# Altium project koruza-compute-module-board.PrjPcb (part 4 of 6)

## Sheet PAGE3 - HUB, USB, ETH.SchDoc
size A3; DocumentNumber: 3; SheetNumber: 3; SheetTotal: 4
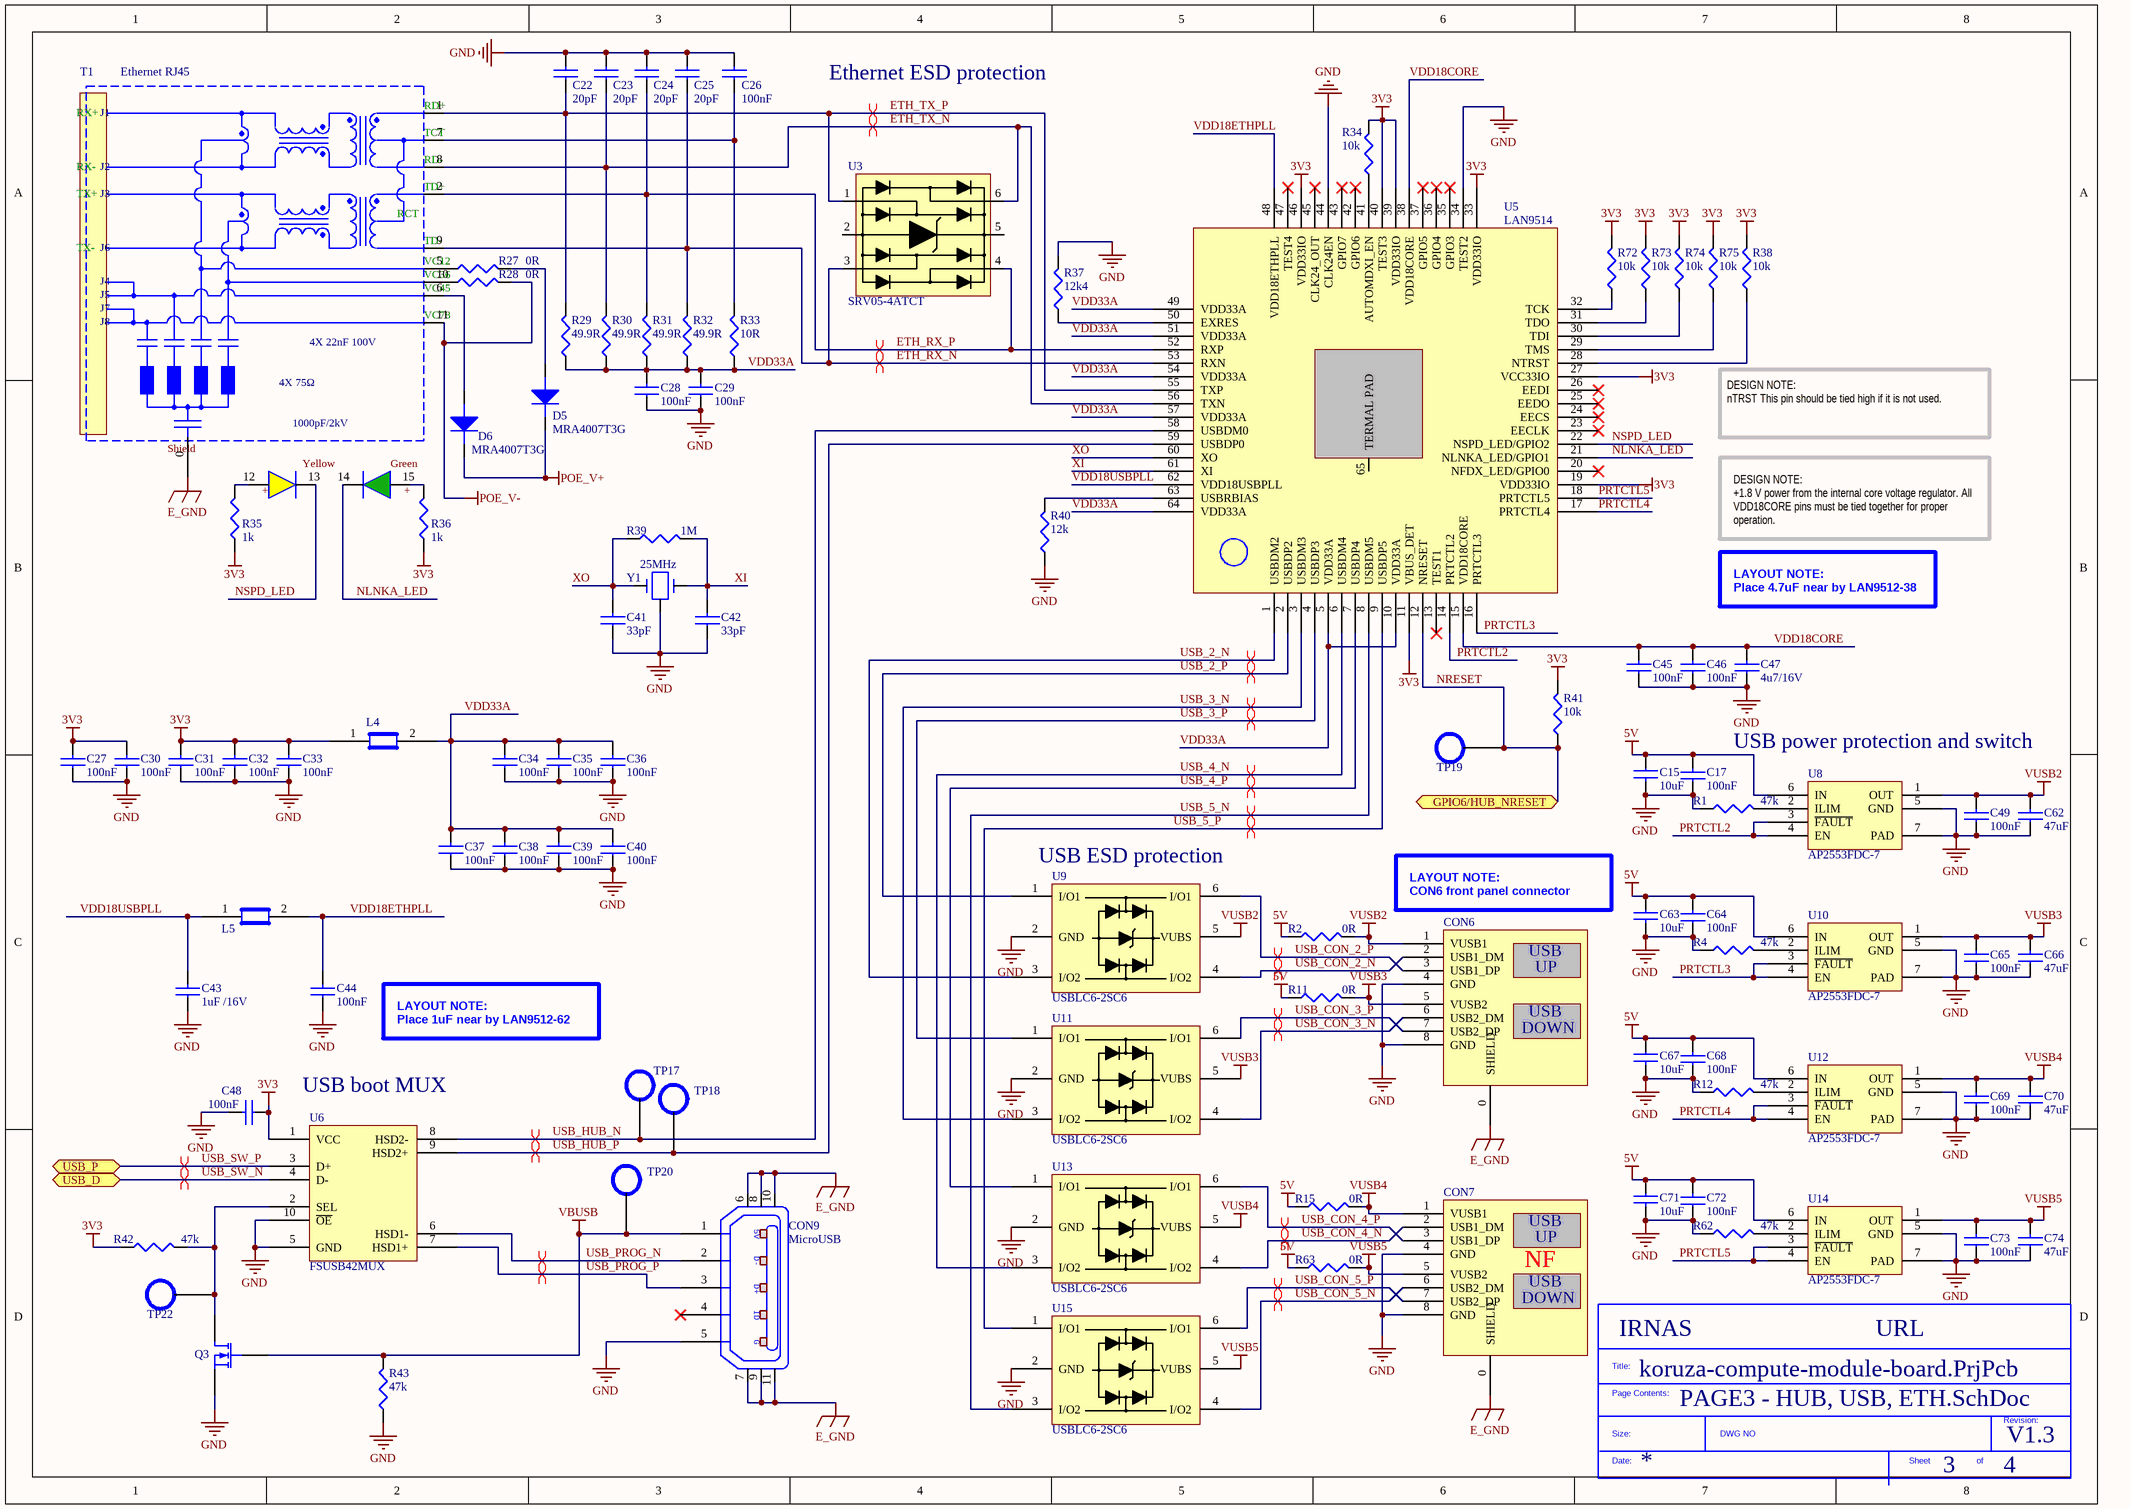
[diagram p3: PAGE3 - HUB, USB, ETH.SchDoc]

### Parts
(Parts that share a designator on the sheet are numbered #1, #2 ... from top to bottom, then left to right.)
*?#3  SDTitleBlock  (value not drawn)  (graphical)
C15  10uF  [CAP1206]
C17  100nF  [CAP0603]
C22  20pF  [CAP0603]
C23  20pF  [CAP0603]
C24  20pF  [CAP0603]
C25  20pF  [CAP0603]
C26  100nF  [CAP0603]
C27  100nF  [CAP0603]
C28  100nF  [CAP0603]
C29  100nF  [CAP0603]
C30  100nF  [CAP0603]
C31  100nF  [CAP0603]
C32  100nF  [CAP0603]
C33  100nF  [CAP0603]
C34  100nF  [CAP0603]
C35  100nF  [CAP0603]
C36  100nF  [CAP0603]
C37  100nF  [CAP0603]
C38  100nF  [CAP0603]
C39  100nF  [CAP0603]
C40  100nF  [CAP0603]
C41  33pF  [CAP0603]
C42  33pF  [CAP0603]
C43  1uF /16V  [CAP0603]
C44  100nF  [CAP0603]
C45  100nF  [CAP0603]
C46  100nF  [CAP0603]
C47  4u7/16V  [CAP0603]
C48  100nF  [CAP0603]
C49  100nF  [CAP0603]
C62  47uF  [CAP0805]
C63  10uF  [CAP1206]
C64  100nF  [CAP0603]
C65  100nF  [CAP0603]
C66  47uF  [CAP0805]
C67  10uF  [CAP1206]
C68  100nF  [CAP0603]
C69  100nF  [CAP0603]
C70  47uF  [CAP0805]
C71  10uF  [CAP1206]
C72  100nF  [CAP0603]
C73  100nF  [CAP0603]
C74  47uF  [CAP0805]
CON6  DUAL USB CONNECTOR  [DUAL_USB_CONN]  (value not drawn)
CON7  DUAL USB CONNECTOR  [DUAL_USB_CONN]  (value not drawn)
CON9  MicroUSB  [10118193]
D5  MRA4007T3G  [DIOM4326X24N_1]
D6  MRA4007T3G  [DIOM4326X24N_1]
L4  BLM18EG221SN1D  [CAP0603]  (value not drawn)
L5  BLM18EG221SN1D  [CAP0603]  (value not drawn)
Q3  DMG1012T-7  [DMG1012T-7]  (value not drawn)
R1  47k  [RES0603]
R2  0R  [RES0603]
R4  47k  [RES0603]
R11  0R  [RES0603]
R12  47k  [RES0603]
R15  0R  [RES0603]
R27  0R  [RES1206]
R28  0R  [RES1206]
R29  49.9R  [RES0603]
R30  49.9R  [RES0603]
R31  49.9R  [RES0603]
R32  49.9R  [RES0603]
R33  10R  [RES0603]
R34  10k  [RES0603]
R35  1k  [RES0603]
R36  1k  [RES0603]
R37  12k4  [RES0603]
R38  10k  [RES0603]
R39  1M  [RES0603]
R40  12k  [RES0603]
R41  10k  [RES0603]
R42  47k  [RES0603]
R43  47k  [RES0603]
R62  47k  [RES0603]
R63  0R  [RES0603]
R72  10k  [RES0603]
R73  10k  [RES0603]
R74  10k  [RES0603]
R75  10k  [RES0603]
T1  Ethernet RJ45  [0826-1L1T-57-F]
TP17  TEST_POINT  [TEST_POINT]  (value not drawn)  (no BOM)
TP18  TEST_POINT  [TEST_POINT]  (value not drawn)  (no BOM)
TP19  TEST_POINT  [TEST_POINT]  (value not drawn)  (no BOM)
TP20  TEST_POINT  [TEST_POINT]  (value not drawn)  (no BOM)
TP22  TEST_POINT  [TEST_POINT]  (value not drawn)  (no BOM)
U3  SRV05-4ATCT  [SOT23127P600-8N]
U5  LAN9514  [QFN64]
U6  FSUSB42MUX  [MO-187]
U8  AP2553FDC-7  [SON65P200X63_HS-7N]
U9  USBLC6-2SC6  [SOT23127P600-8N]
U10  AP2553FDC-7  [SON65P200X63_HS-7N]
U11  USBLC6-2SC6  [SOT23127P600-8N]
U12  AP2553FDC-7  [SON65P200X63_HS-7N]
U13  USBLC6-2SC6  [SOT23127P600-8N]
U14  AP2553FDC-7  [SON65P200X63_HS-7N]
U15  USBLC6-2SC6  [SOT23127P600-8N]
Y1  25MHz  [XTAL_small]

### Ports
GPIO6/HUB_NRESET (bidir), USB_D (bidir), USB_P (bidir)

### Nets
3V3: C27.2 C30.2 C31.2 C32.2 C33.2 C48.1 L4.1 R34.2 R35.1 R36.1 R38.2 R41.2 R42.1 R72.2 R73.2 R74.2 R75.2 U5.11(VBUS_DET) U5.19(VDD33IO) U5.27(VCC33IO) U5.33(VDD33IO) U5.39(VDD33IO) U5.40(TEST3) U5.46(VDD33IO) U6.1(VCC)
5V: C15.1 C17.2 C63.1 C64.2 C67.1 C68.2 C71.1 C72.2 R2.1 R11.1 R15.1 R63.1 U8.6(IN) U10.6(IN) U12.6(IN) U14.6(IN)
E_GND: CON6.0(SHIELD) CON7.0(SHIELD) CON9.6 CON9.7 CON9.8 CON9.9 CON9.10 CON9.11 T1.0(Shield)
GND: C15.2 C17.1 C22.2 C23.2 C24.2 C25.2 C26.2 C27.1 C28.1 C29.1 C30.1 C31.1 C32.1 C33.1 C34.1 C35.1 C36.1 C37.1 C38.1 C39.1 C40.1 C41.1 C42.1 C43.1 C44.1 C45.1 C46.1 C47.1 C48.2 C49.1 C62.1 C63.2 C64.1 C65.1 C66.1 C67.2 C68.1 C69.1 C70.1 C71.2 C72.1 C73.1 C74.1 CON6.4(GND) CON6.8(GND) CON7.4(GND) CON7.8(GND) CON9.5(P5) Q3.3(S) R1.1 R4.1 R12.1 R37.2 R40.1 R43.1 R62.1 U5.34(TEST2) U5.44(CLK24EN) U5.65(TERMAL_PAD) U6.5(GND) U6.10(~{OE}) U8.5(GND) U8.7(PAD) U9.2(GND) U10.5(GND) U10.7(PAD) U11.2(GND) U12.5(GND) U12.7(PAD) U13.2(GND) U14.5(GND) U14.7(PAD) U15.2(GND) Y1.3
POE_V+: D5.1(cathode) D6.1(cathode)
POE_V-: R28.2 T1.11(VC78)
VBUSB: CON9.1(P1) Q3.2(G) R43.2 TP20.1(TP)
VUSB2: C49.2 C62.2 CON6.1(VUSB1) R2.2 U8.1(OUT) U9.5(VUBS)
VUSB3: C65.2 C66.2 CON6.5(VUSB2) R11.2 U10.1(OUT) U11.5(VUBS)
VUSB4: C69.2 C70.2 CON7.1(VUSB1) R15.2 U12.1(OUT) U13.5(VUBS)
VUSB5: C73.2 C74.2 CON7.5(VUSB2) R63.2 U14.1(OUT) U15.5(VUBS)
ETH_RX_N: C25.1 R32.2 T1.9(TD-) U3.3 U5.53(RXN)
ETH_RX_P: C24.1 R31.2 T1.2(TD+) U3.4 U5.52(RXP)
ETH_TX_N: C23.1 R30.2 T1.8(RD-) U3.6 U5.56(TXN)
ETH_TX_P: C22.1 R29.2 T1.1(RD+) U3.1 U5.55(TXP)
NLNKA_LED: T1.14 U5.21(NLNKA_LED/GPIO1)
NRESET: R41.1 TP19.1(TP) U5.12(NRESET) ; port GPIO6/HUB_NRESET
NSPD_LED: T1.13 U5.22(NSPD_LED/GPIO2)
PRTCTL2: U5.14(PRTCTL2) U8.3(~{FAULT}) U8.4(EN)
PRTCTL3: U5.16(PRTCTL3) U10.3(~{FAULT}) U10.4(EN)
PRTCTL4: U5.17(PRTCTL4) U12.3(~{FAULT}) U12.4(EN)
PRTCTL5: U5.18(PRTCTL5) U14.3(~{FAULT}) U14.4(EN)
USB_2_N: U5.1(USBDM2) U9.3(I/O2)
USB_2_P: U5.2(USBDP2) U9.1(I/O1)
USB_3_N: U5.3(USBDM3) U11.3(I/O2)
USB_3_P: U5.4(USBDP3) U11.1(I/O1)
USB_4_N: U5.6(USBDM4) U13.3(I/O2)
USB_4_P: U5.7(USBDP4) U13.1(I/O1)
USB_5_N: U5.8(USBDM5) U15.3(I/O2)
USB_5_P: U5.9(USBDP5) U15.1(I/O1)
USB_CON_2_N: CON6.2(USB1_DM) U9.4(I/O2)
USB_CON_2_P: CON6.3(USB1_DP) U9.6(I/O1)
USB_CON_3_N: CON6.6(USB2_DM) U11.4(I/O2)
USB_CON_3_P: CON6.7(USB2_DP) U11.6(I/O1)
USB_CON_4_N: CON7.2(USB1_DM) U13.4(I/O2)
USB_CON_4_P: CON7.3(USB1_DP) U13.6(I/O1)
USB_CON_5_N: CON7.6(USB2_DM) U15.4(I/O2)
USB_CON_5_P: CON7.7(USB2_DP) U15.6(I/O1)
USB_HUB_N: TP17.1(TP) U5.58(USBDM0) U6.8(HSD2-)
USB_HUB_P: TP18.1(TP) U5.59(USBDP0) U6.9(HSD2+)
USB_PROG_N: CON9.2(P2) U6.6(HSD1-)
USB_PROG_P: CON9.3(P3) U6.7(HSD1+)
USB_SW_N: U6.4(D-) ; port USB_D
USB_SW_P: U6.3(D+) ; port USB_P
VDD18CORE: C45.2 C46.2 C47.2 U5.15(VDD18CORE) U5.38(VDD18CORE)
VDD18ETHPLL: C44.2 L5.2 U5.48(VDD18ETHPLL)
VDD18USBPLL: C43.2 L5.1 U5.62(VDD18USBPLL)
VDD33A: C28.2 C29.2 C34.2 C35.2 C36.2 C37.2 C38.2 C39.2 C40.2 L4.2 R29.1 R30.1 R31.1 R32.1 R33.1 U5.5(VDD33A) U5.10(VDD33A) U5.49(VDD33A) U5.51(VDD33A) U5.54(VDD33A) U5.57(VDD33A) U5.64(VDD33A)
XI: C42.2 R39.2 U5.61(XI) Y1.2
XO: C41.2 R39.1 U5.60(XO) Y1.1
NetC26_1: C26.1 R33.2 T1.7(CT)
NetD5_2: D5.2(ANODE) R27.2
NetD6_2: D6.2(ANODE) T1.6(VC45)
NetQ3_1: Q3.1(D) R42.2 TP22.1(TP) U6.2(SEL)
NetR1_2: R1.2 U8.2(ILIM)
NetR4_2: R4.2 U10.2(ILIM)
NetR12_2: R12.2 U12.2(ILIM)
NetR27_1: R27.1 T1.5(VC12)
NetR28_1: R28.1 T1.10(VC36)
NetR34_1: R34.1 U5.41(AUTOMDXI_EN)
NetR35_2: R35.2 T1.12
NetR36_2: R36.2 T1.15
NetR37_1: R37.1 U5.50(EXRES)
NetR38_1: R38.1 U5.28(NTRST)
NetR40_2: R40.2 U5.63(USBRBIAS)
NetR62_2: R62.2 U14.2(ILIM)
NetR72_1: R72.1 U5.32(TCK)
NetR73_1: R73.1 U5.31(TDO)
NetR74_1: R74.1 U5.30(TDI)
NetR75_1: R75.1 U5.29(TMS)

Not connected (* = marked no-connect by the designer): CON9 4(P4)*; U3 2 5; U5 13(TEST1)* 20(NFDX_LED/GPIO0)* 23(EECLK)* 24(EECS)* 25(EEDO)* 26(EEDI)* 35(GPIO3)* 36(GPIO4)* 37(GPIO5)* 42(GPIO6)* 43(GPIO7)* 45(CLK24_OUT)* 47(TEST4)*

### Layout directives
differential pair: ETH_RX_N, ETH_RX_P, ETH_TX_N, ETH_TX_P, USB_2_N, USB_2_P, USB_3_N, USB_3_P, USB_4_N, USB_4_P, USB_5_N, USB_5_P, USB_CON_2_N, USB_CON_2_P, USB_CON_3_N, USB_CON_3_P, USB_CON_4_N, USB_CON_4_P, USB_CON_5_N, USB_CON_5_P, USB_HUB_N, USB_HUB_P, USB_PROG_N, USB_PROG_P, USB_SW_N, USB_SW_P

### Notes on the sheet
- Ethernet ESD protection
- DESIGN NOTE:
  nTRST This pin should be tied high if it is not used.
- DESIGN NOTE:
  +1.8 V power from the internal core voltage regulator. All VDD18CORE pins must be tied together for proper operation.
- LAYOUT NOTE:
  Place 4.7uF near by LAN9512-38
- USB power protection and switch
- (near U9) USB ESD protection
- LAYOUT NOTE:
  CON6 front panel connector
- LAYOUT NOTE:
  Place 1uF near by LAN9512-62
- USB boot MUX
- NF
- (in symbol Ethernet RJ45) RX+; J1; TCT; RX-; J2; TX+; J3; RCT; TX-; J6; J4; J5; J7; J8; 4X 22nF 100V; 4X 75Ω; 1000pF/2kV; Yellow; Green; +
- (in symbol MicroUSB) 5V; D-; D+; ID; G
- (in symbol SDTitleBlock) Title:; Page Contents:; Revision:; Size:; DWG NO; Date:; Sheet; of
- (in symbol USB_2_CONN) USB; UP; DOWN